# EAGLE design H26R10 (EAGLE 9.3.0)

## Sheet 1 of 2
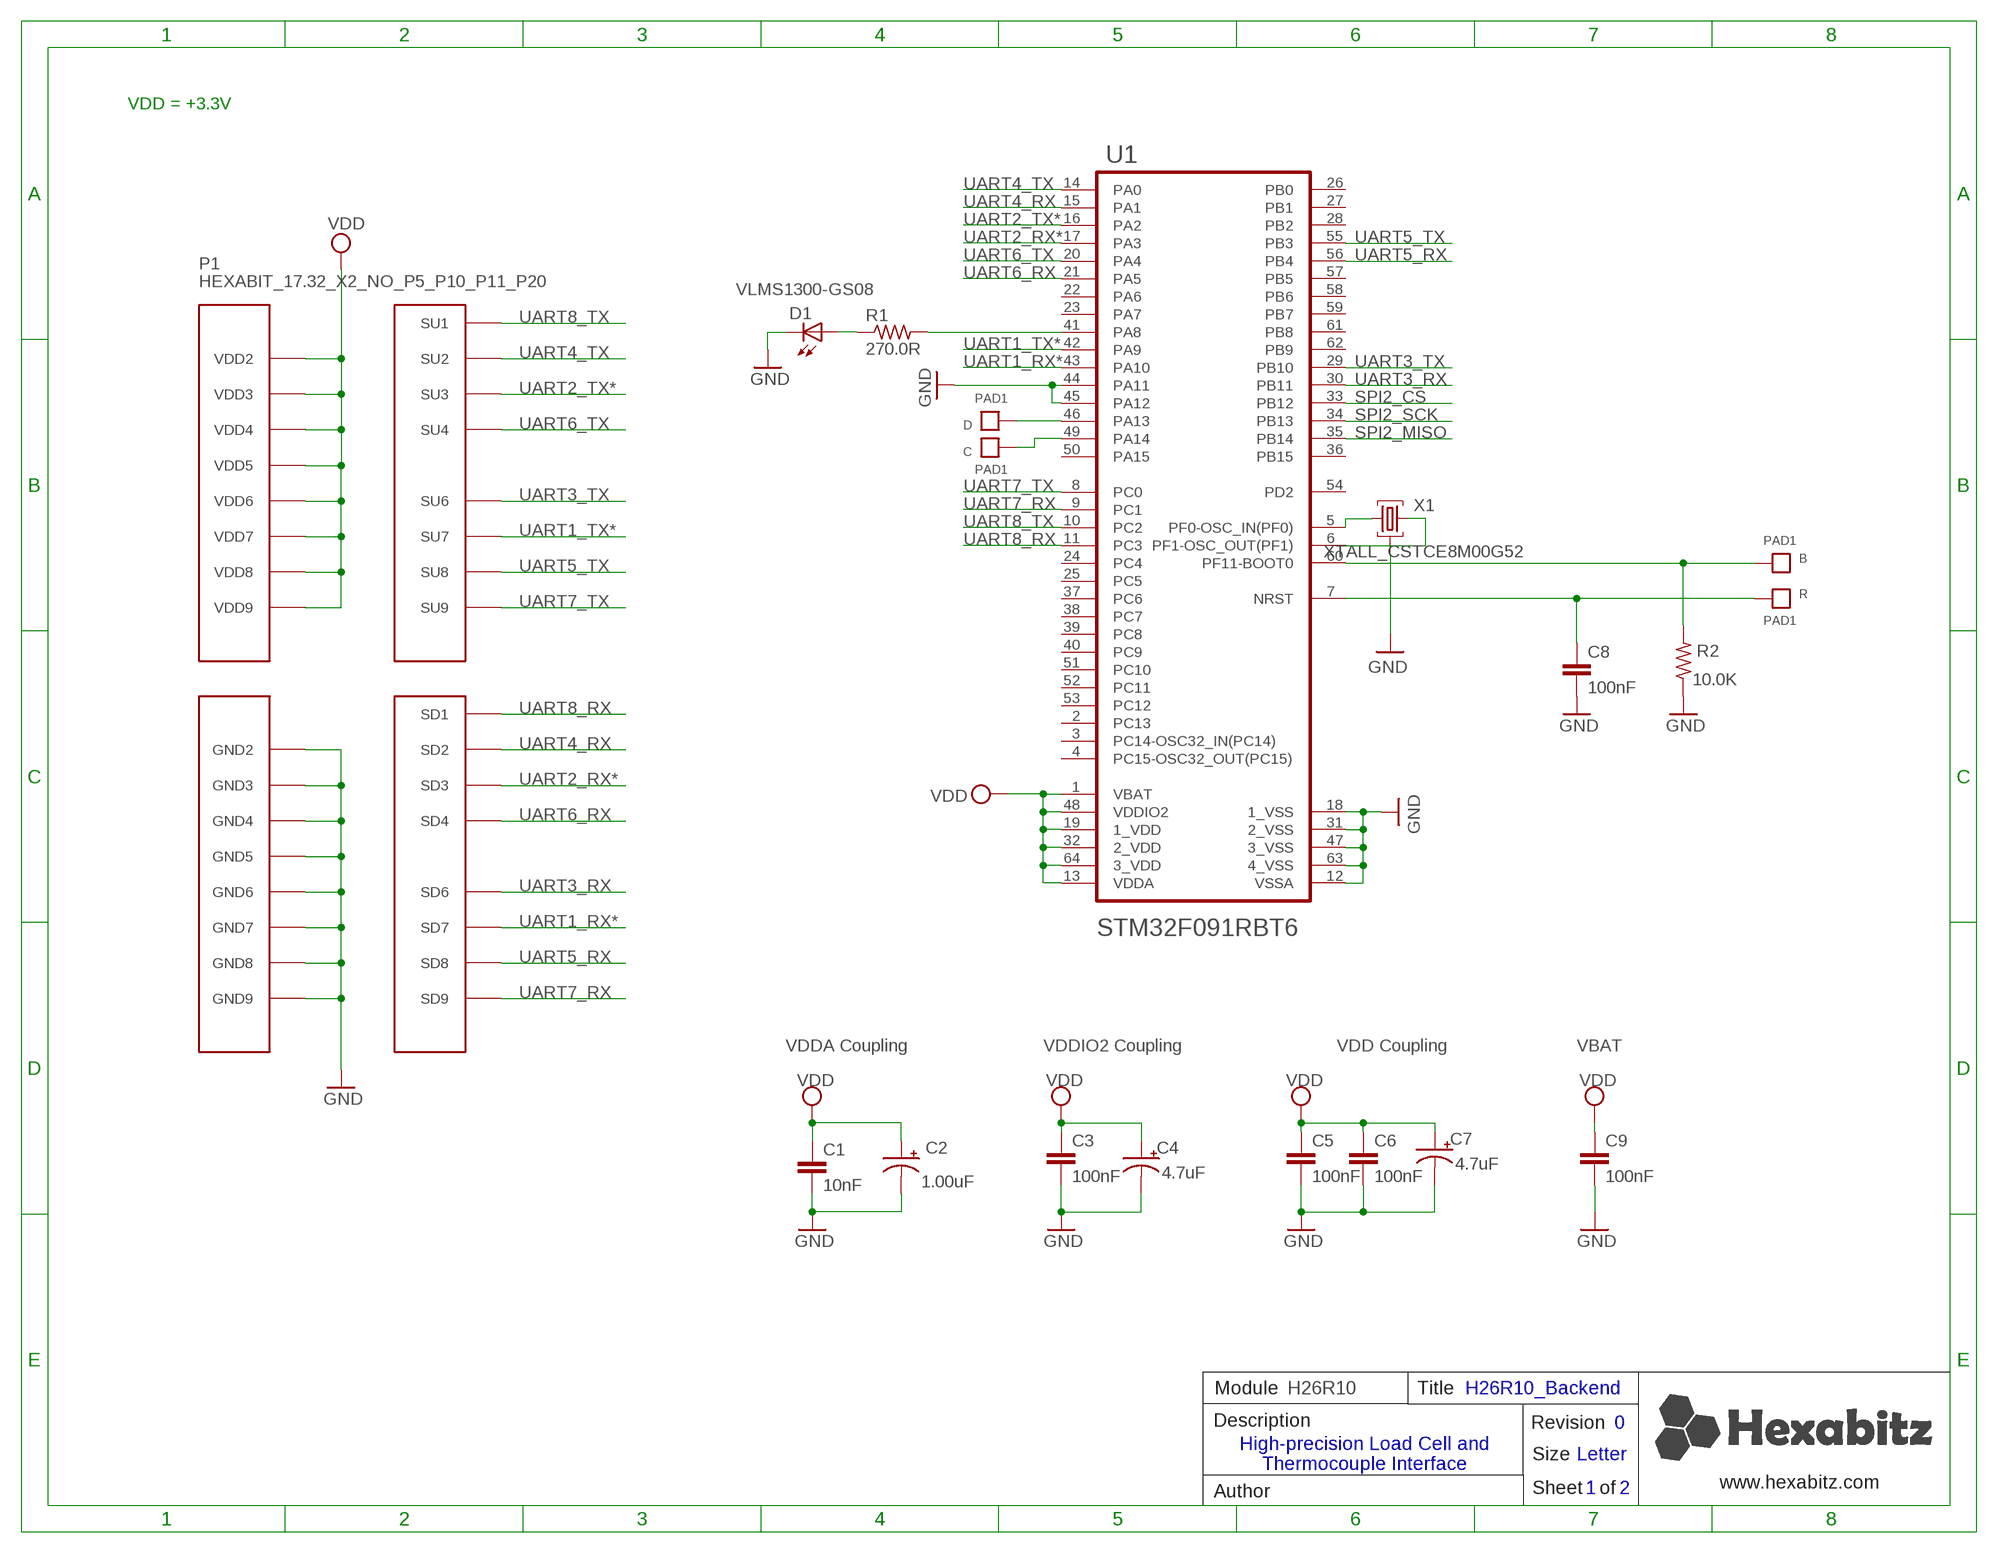
[diagram p0: schematic, sheet 1]

### Parts
B  PAD1  [PAD1]
C  PAD1  [PAD1]
C1  10nF  C-0603  [C-0603]
C2  1.00uF  C-0805-POL  [C-0805-POL]
C3  100nF  C-0603  [C-0603]
C4  4.7uF  C-0805-POL  [C-0805-POL]
C5  100nF  C-0603  [C-0603]
C6  100nF  C-0603  [C-0603]
C7  4.7uF  C-0805-POL  [C-0805-POL]
C8  100nF  C-0603  [C-0603]
C9  100nF  C-0603  [C-0603]
D  PAD1  [PAD1]
D1  VLMS1300-GS08  [VLMS1300-GS08]
P1  HEXABIT_17.32_X2_NO_P5_P10_P11_P20  [HEXABIT_17.32_X2_NO_P5_P10_P11_P20]
R  PAD1  [PAD1]
R1  270.0R  R-0603  [R-0603]
R2  10.0K  R-0603  [R-0603]
U1  STM32F091RBT6STMICROELECTRONICS_STM32F091RBT6_0_1  [STMICROELECTRONICS_STM32F091RBT6_1]
X1  XTALL_CSTCE8M00G52  [XTALL_CSTCE8M00G52]

### Nets
B1: B.P$1 B.P$2 R2.2 U1.60(PF11-BOOT0)
GND: C1.2 C2.2(-) C3.2 C4.2(-) C5.2 C6.2 C7.2(-) C8.2 C9.2 D1.C P1.PAD_PD12(GND2) P1.PAD_PD13(GND3) P1.PAD_PD14(GND4) P1.PAD_PD15(GND5) P1.PAD_PD16(GND6) P1.PAD_PD17(GND7) P1.PAD_PD18(GND8) P1.PAD_PD19(GND9) R2.1 U1.12(VSSA) U1.18(1_VSS) U1.31(2_VSS) U1.44(PA11) U1.45(PA12) U1.47(3_VSS) U1.63(4_VSS) X1.P$2 ; also sheet 2
N$3: R1.2 U1.41(PA8)
N$4: D1.A R1.1
N$5: U1.5(PF0-OSC_IN(PF0)) X1.P$1
N$6: U1.6(PF1-OSC_OUT(PF1)) X1.P$3
N$7: D.P$1 D.P$2 U1.46(PA13)
N$9: C.P$1 C.P$2 U1.49(PA14)
R1: C8.1 R.P$1 R.P$2 U1.7(NRST)
SPI2_CS: U1.33(PB12) ; also sheet 2
SPI2_MISO: U1.35(PB14) ; also sheet 2
SPI2_SCK: U1.34(PB13) ; also sheet 2
UART1_RX*: P1.PAD_PD7(SD7) U1.43(PA10)
UART1_TX*: P1.PAD_PU7(SU7) U1.42(PA9)
UART2_RX*: P1.PAD_PD3(SD3) U1.17(PA3)
UART2_TX*: P1.PAD_PU3(SU3) U1.16(PA2)
UART3_RX: P1.PAD_PD6(SD6) U1.30(PB11)
UART3_TX: P1.PAD_PU6(SU6) U1.29(PB10)
UART4_RX: P1.PAD_PD2(SD2) U1.15(PA1)
UART4_TX: P1.PAD_PU2(SU2) U1.14(PA0)
UART5_RX: P1.PAD_PD8(SD8) U1.56(PB4)
UART5_TX: P1.PAD_PU8(SU8) U1.55(PB3)
UART6_RX: P1.PAD_PD4(SD4) U1.21(PA5)
UART6_TX: P1.PAD_PU4(SU4) U1.20(PA4)
UART7_RX: P1.PAD_PD9(SD9) U1.9(PC1)
UART7_TX: P1.PAD_PU9(SU9) U1.8(PC0)
UART8_RX: P1.PAD_PD1(SD1) U1.11(PC3)
UART8_TX: P1.PAD_PU1(SU1) U1.10(PC2)
VDD: C1.1 C2.1(+) C3.1 C4.1(+) C5.1 C6.1 C7.1(+) C9.1 P1.PAD_PU12(VDD2) P1.PAD_PU13(VDD3) P1.PAD_PU14(VDD4) P1.PAD_PU15(VDD5) P1.PAD_PU16(VDD6) P1.PAD_PU17(VDD7) P1.PAD_PU18(VDD8) P1.PAD_PU19(VDD9) U1.1(VBAT) U1.13(VDDA) U1.19(1_VDD) U1.32(2_VDD) U1.48(VDDIO2) U1.64(3_VDD) ; also sheet 2
Unconnected: U1.2(PC13) U1.3(PC14-OSC32_IN(PC14)) U1.4(PC15-OSC32_OUT(PC15)) U1.22(PA6) U1.23(PA7) U1.24(PC4) U1.25(PC5) U1.26(PB0) U1.27(PB1) U1.28(PB2) U1.36(PB15) U1.37(PC6) U1.38(PC7) U1.39(PC8) U1.40(PC9) U1.50(PA15) U1.51(PC10) U1.52(PC11) U1.53(PC12) U1.54(PD2) U1.57(PB5) U1.58(PB6) U1.59(PB7) U1.61(PB8) U1.62(PB9)

### Notes on the sheet
- VDD = +3.3V
- VDDA Coupling | VDDIO2 Coupling | VDD Coupling | VBAT
- Module | H26R10 | Title | H26R10_Backend
- Description | Revision | 0
- High-precision Load Cell and
  Thermocouple Interface
- Size | Letter
- www.hexabitz.com
- Author | Sheet   of | 1 | 2
- C:/Users/Admin/Desktop/logodraft.bmp

## Sheet 2 of 2
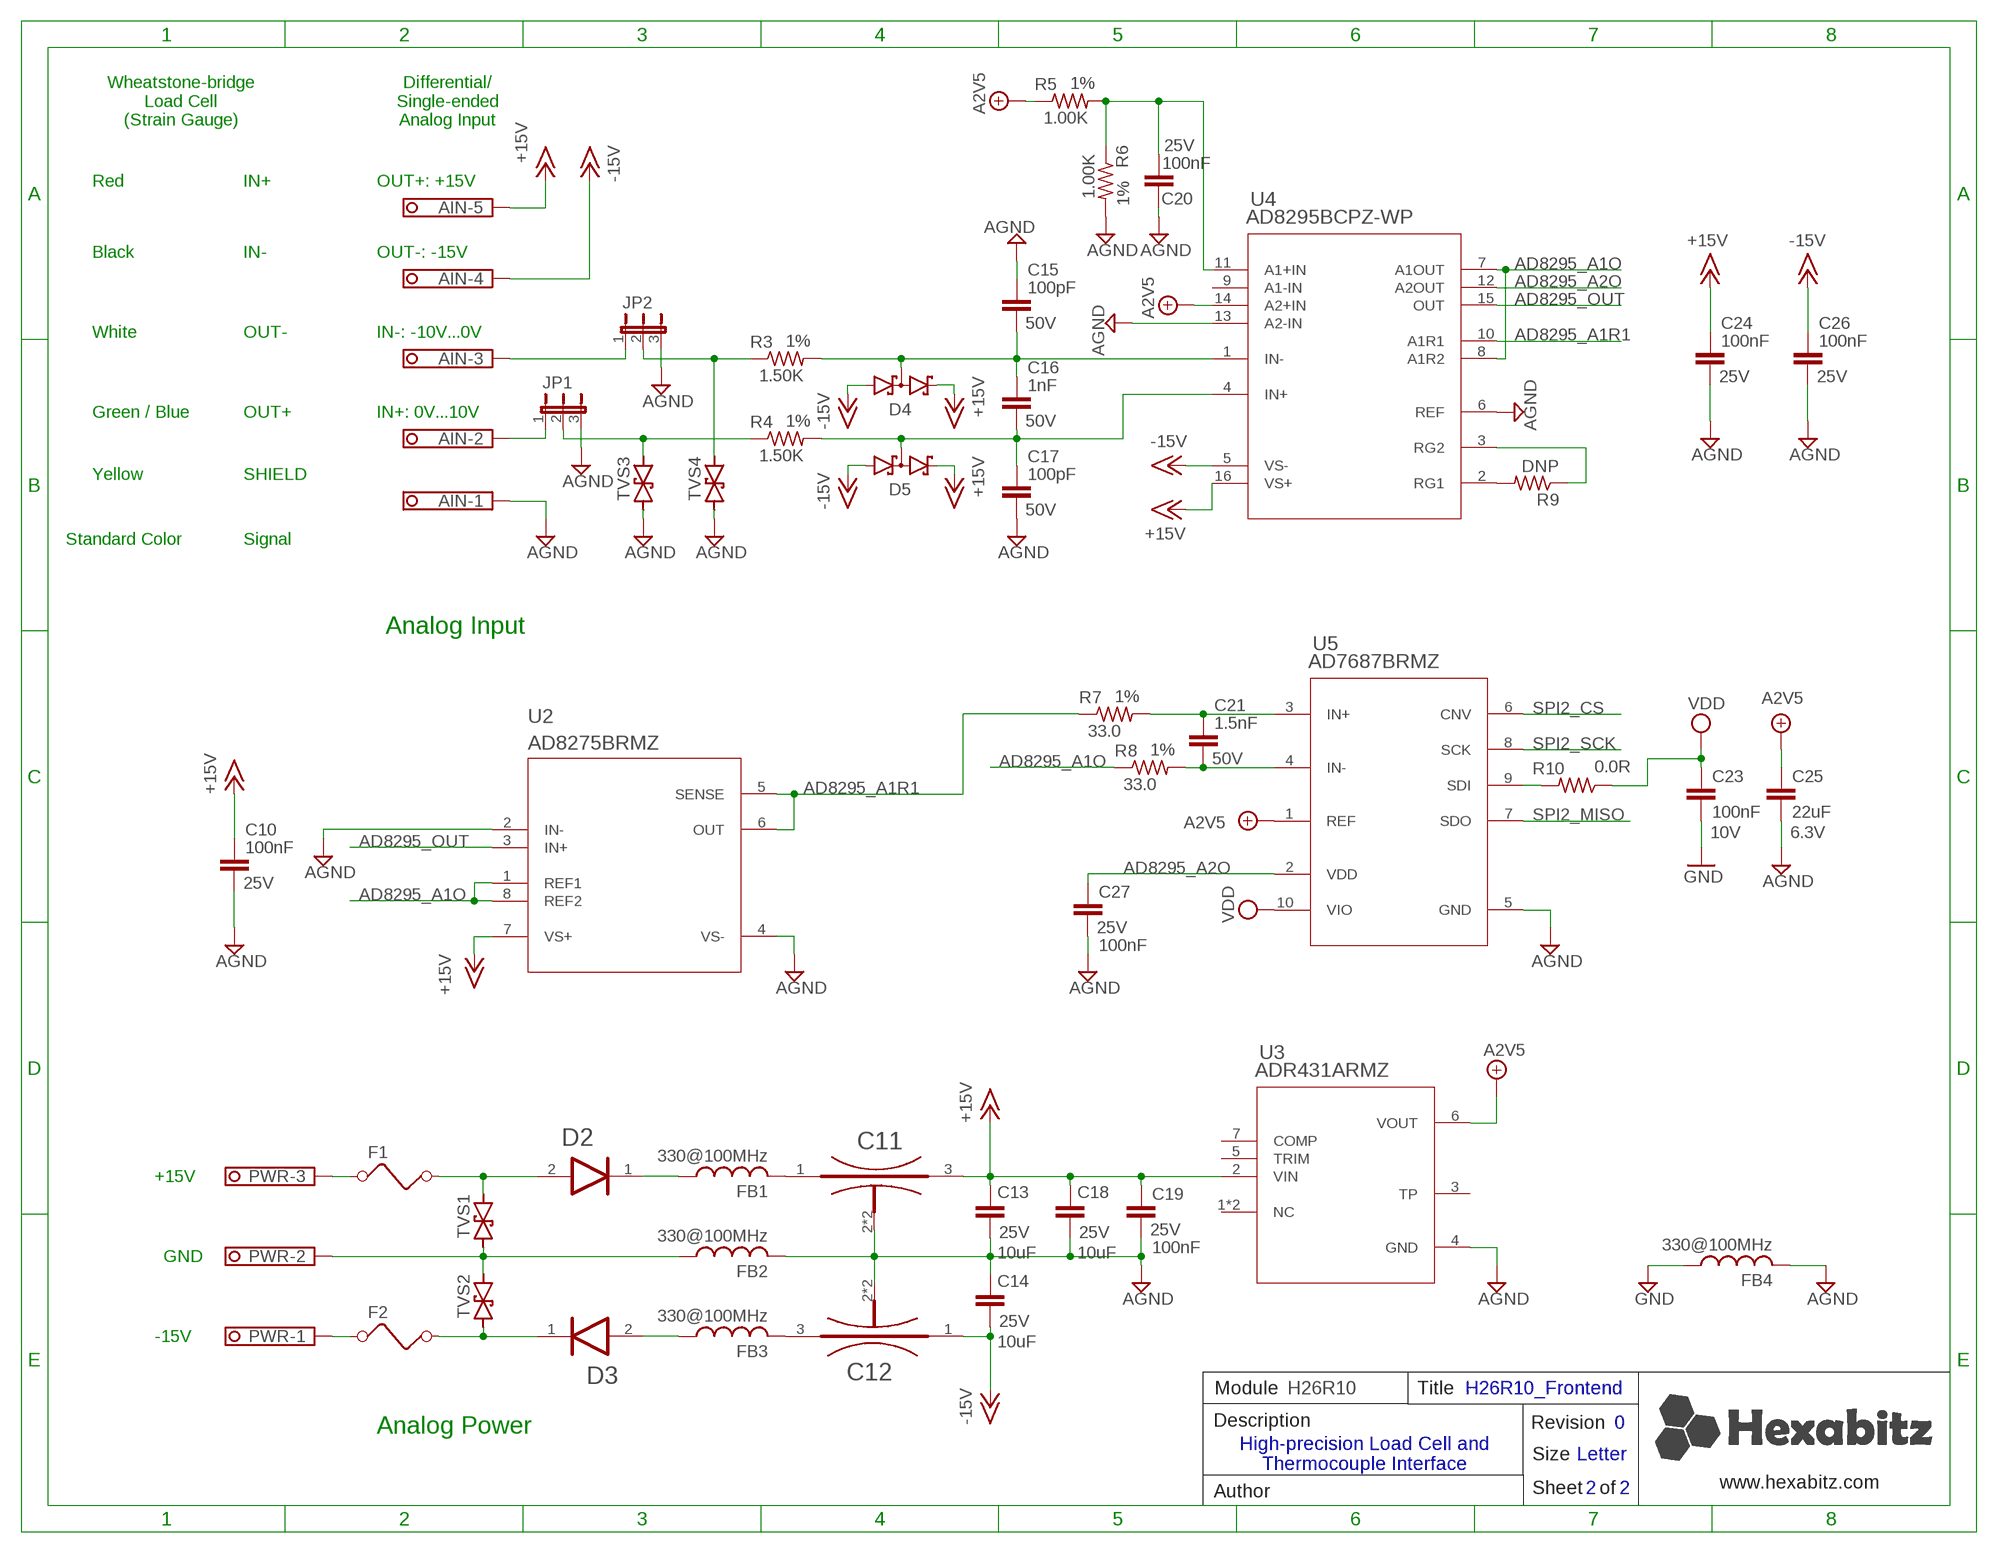
[diagram p1: schematic, sheet 2]

### Parts
AIN  CON-PHOENIX-350_1751277  [CON-PHOENIX-350_1751277]
C10  100nF  C-0603  [C-0603]
C11  MURATA_NFM21PC105B1A3DMURATA_NFM21PC105B1A3D_0_0  [MURATA_NFM21PC105B1A3D_0]
C12  MURATA_NFM21PC105B1A3DMURATA_NFM21PC105B1A3D_0_0  [MURATA_NFM21PC105B1A3D_0]
C13  10uF  C-1206  [C1206K]
C14  10uF  C-1206  [C1206K]
C15  100pF  C-0603  [C-0603]
C16  1nF  C-0603  [C-0603]
C17  100pF  C-0603  [C-0603]
C18  10uF  C-1206  [C1206K]
C19  100nF  C-0603  [C-0603]
C20  100nF  C-0603  [C-0603]
C21  1.5nF  C-0603  [C-0603]
C23  100nF  C-0603  [C-0603]
C24  100nF  C-0603  [C-0603]
C25  22uF  C-1206  [C1206K]
C26  100nF  C-0603  [C-0603]
C27  100nF  C-0603  [C-0603]
D2  DIODES_SBR2U30P1-7DIODES_SBR2U30P1-7_0_0  [DIODES_SBR2U30P1-7_0]
D3  DIODES_SBR2U30P1-7DIODES_SBR2U30P1-7_0_0  [DIODES_SBR2U30P1-7_0]
D4  BAT54S  [SOT23]
D5  BAT54S  [SOT23]
F1  NANOSMDC035F-2120  [R1206]
F2  NANOSMDC035F-2120  [R1206]
FB1  330@100MHz  FB-0805  [FB-0805]
FB2  330@100MHz  FB-0805  [FB-0805]
FB3  330@100MHz  FB-0805  [FB-0805]
FB4  330@100MHz  FB-0805  [FB-0805]
JP1  JP2E  [JP2]
JP2  JP2E  [JP2]
PWR  1751251  [1751251]
R3  1.50K  R-0603  [R-0603]
R4  1.50K  R-0603  [R-0603]
R5  1.00K  R-0603  [R-0603]
R6  1.00K  R-0603  [R-0603]
R7  33.0  R-0603  [R-0603]
R8  33.0  R-0603  [R-0603]
R9  DNP  R-0805  [R-0805]
R10  0.0R  R-0603  [R-0603]
TVS1  SMBJ30CA  [DO214AA]
TVS2  SMBJ30CA  [DO214AA]
TVS3  SMBJ30CA  [DO214AA]
TVS4  SMBJ30CA  [DO214AA]
U2  AD8275BRMZ  [RM_8]
U3  ADR431ARMZ  [RM_8]
U4  AD8295BCPZ-WP  [CP_16_19]
U5  AD7687BRMZ  [RM_10]

### Nets
+2.5V: C25.1 R5.1 U3.6(VOUT) U4.14(A2+IN) U5.1(REF) ; supply symbol labelled A2V5
+15V: AIN.5 C10.1 C11.3(OUTPUT) C13.1 C18.1 C19.1 C24.1 D4.2(C2) D5.2(C2) U2.7(VS+) U3.2(VIN) U4.16(VS+)
-15V: AIN.4 C12.1(INPUT) C14.2 C26.1 D4.1(A1) D5.1(A1) U4.5(VS-)
AD8295_A1O: R8.1 U2.1(REF1) U2.8(REF2) U4.7(A1OUT) U4.8(A1R2)
AD8295_A1R1: R7.1 U2.5(SENSE) U2.6(OUT) U4.10(A1R1)
AD8295_A2O: C27.1 U4.12(A2OUT) U5.2(VDD)
AD8295_OUT: U2.3(IN+) U4.15(OUT)
AGND: AIN.1 C10.2 C11.2(GND) C11.2-2(GND) C12.2(GND) C12.2-2(GND) C13.2 C14.1 C15.1 C17.2 C18.2 C19.2 C20.1 C24.2 C25.2 C26.2 C27.2 FB2.2 FB4.2 JP1.3 JP2.3 R6.2 TVS3.A TVS4.A U2.2(IN-) U2.4(VS-) U3.4(GND) U4.6(REF) U4.13(A2-IN) U5.5(GND)
GND: C23.2 FB4.1 ; also sheet 1
N$1: AIN.3 JP2.1
N$2: AIN.2 JP1.1
N$8: JP2.2 R3.1 TVS4.C
N$10: JP1.2 R4.1 TVS3.C
N$11: C15.2 C16.1 D4.3(C1A2) R3.2 U4.1(IN-)
N$12: C16.2 C17.1 D5.3(C1A2) R4.2 U4.4(IN+)
N$13: R9.2 U4.2(RG1)
N$14: R9.1 U4.3(RG2)
N$15: F1.1 PWR.3
N$16: F2.1 PWR.1
N$17: D2.2(ANODE) F1.2 TVS1.C
N$18: D3.1(CATHODE) F2.2 TVS2.A
N$19: FB2.1 PWR.2 TVS1.A TVS2.C
N$20: D2.1(CATHODE) FB1.1
N$21: D3.2(ANODE) FB3.1
N$22: C11.1(INPUT) FB1.2
N$23: C12.3(OUTPUT) FB3.2
N$25: C20.2 R5.2 R6.1 U4.11(A1+IN)
N$26: R10.2 U5.9(SDI)
N$27: C21.1 R7.2 U5.3(IN+)
N$28: C21.2 R8.2 U5.4(IN-)
SPI2_CS: U5.6(CNV) ; also sheet 1
SPI2_MISO: U5.7(SDO) ; also sheet 1
SPI2_SCK: U5.8(SCK) ; also sheet 1
VDD: C23.1 R10.1 U5.10(VIO) ; also sheet 1
Unconnected: U3.1(NC) U3.3(TP) U3.5(TRIM) U3.7(COMP) U3.8(NC) U4.9(A1-IN)

### Notes on the sheet
- Wheatstone-bridge
  Load Cell
  (Strain Gauge)
- Differential/
  Single-ended
  Analog Input
- Red | IN+ | OUT+: +15V
- Black | IN- | OUT-: -15V
- White | OUT- | IN-: -10V...0V
- Green / Blue | OUT+ | IN+: 0V...10V
- Yellow | SHIELD
- Standard Color | Signal
- Analog Input
- +15V
- GND
- -15V
- Module | H26R10 | Title | H26R10_Frontend
- Description | Revision | 0
- Analog Power
- High-precision Load Cell and
  Thermocouple Interface
- Size | Letter
- www.hexabitz.com
- Author | Sheet   of | 2 | 2

## Library data of the parts
AIN = Hexabitz:CON-PHOENIX-350_1751277: MKDS 1/ 5-3,5 Printklemme Nennstrom: 10 A Bemessungsspannung: 160 V Raster: 3,5 mm Polzahl: 5 Montageart: Löten Anschlussart: Schraubanschluss Anschlussrichtung vom Leiter zur Platine: 0° Source: http://eshop.phoenixcontact.com .. 1751277.pdf; MFN: Phoenix Contact; MPN: 1984646; OCTOPART_URL: https://octopart.com/1984646-phoenix+contact-50274?r=sp&s=drI_GVM4QHaL48lSCATrxQ; OC_FARNELL: unknown; OC_NEWARK: unknown
B C D R = Hexabitz:PAD1
C1 = Hexabitz:C-0603: CAP CER 10% X7R 0603; CAPACITANCE: 10nF; MFN: KEMET; MPN: C0603C103K5RACTU; OCTOPART_URL: https://octopart.com/c0603c103k5ractu-kemet-133094?r=sp&s=R_iPBxLnSmGqhkU2rIMFpg; TOLERANCE: 10%; VOLTAGE_RATING: 50V
C2 = Hexabitz:C-0805-POL: Cap Tant Solid SMD 2012; CAPACITANCE: 1.00uF; MFN: Yageo; MPN: CC0805KKX7R7BB105; OCTOPART_URL: https://octopart.com/cc0805kkx7r7bb105-yageo-8376555?r=sp&s=YKl1wwtkROau_X5nniH2ig; TOLERANCE: 10%; VOLTAGE_RATING: 16V
C3 C6 C8 C23 = Hexabitz:C-0603: CAP CER 10% X7R 0603; CAPACITANCE: 100nF; MFN: KEMET; MPN: C0603C104K8RACTU; OCTOPART_URL: https://octopart.com/c0603c104k8ractu-kemet-145075?r=sp&s=9bS9ASSwSEqMCE9KBEQZ0g; TOLERANCE: 10%; VOLTAGE_RATING: 10V
C4 C7 = Hexabitz:C-0805-POL: Cap Tant Solid SMD 2012; CAPACITANCE: 4.7uF; MFN: Murata; MPN: GRM21BC81E475KA12L; OCTOPART_URL: https://octopart.com/grm21bc81e475ka12l-murata-10331911?r=sp&s=RY3qZSD8T6mG6TC9CHI5qQ; TOLERANCE: 10%; VOLTAGE_RATING: 25V
C5 = Hexabitz:C-0603: CAP CER 10% X7R 0603; CAPACITANCE: 100nF; MFN: KEMET; MPN: C0603C104K8RACTU; OCTOPART_URL: https://octopart.com/c0603c104k8ractu-kemet-145075?r=sp&s=9bS9ASSwSEqMCE9KBEQZ0g; TOLERANCE: 10%; VOLTAGE_RATING: 10
C9 = Hexabitz:C-0603: CAP CER 10% X7R 0603; CAPACITANCE: 100nF; MFN: KEMET; MPN: C0603C104K8RACTU; OCTOPART_URL: https://octopart.com/c0603c104k8ractu-kemet-145075?r=sp&s=9bS9ASSwSEqMCE9KBEQZ0g; TOLERANCE: 10V; VOLTAGE_RATING: 10%
C10 C24 C26 C27 = Hexabitz:C-0603: CAP CER 10% X7R 0603; CAPACITANCE: 100nF; MFN: Murata; MPN: GRM188R71E104KA01D; OCTOPART_URL: https://octopart.com/grm188r71e104ka01d-murata-196239?r=sp&s=9Sa0iYM-THq9pjXKXbxryA; TOLERANCE: 10%; VOLTAGE_RATING: 25V
C11 C12 = Hexabitz:MURATA_NFM21PC105B1A3D: Large Current 3 Terminals Low ESL Chip Multilayer Ceramic Capacitors (EMIFIL) for General Purpose; CAPACITANCE: 1µF; CENTROID_NOT_SPECIFIED: No; DATASHEET: http://search.murata.co.jp/Ceramy/image/img/A01X/G101/ENG/NFM21PC105B1A3-01.pdf; DIGIKEY_DESCRIPTION: CAP FEEDTHRU 1UF 20% 10V 0805; DIGIKEY_PART_NUMBER: 490-6980-1-ND; LEAD_FREE: yes; MFN: Murata; MOUSER_PART_NUMBER: 81-NFM21PC105B1A3D; MPN: NFM21PC105B1A3D; OCTOPART_URL: https://octopart.com/nfm21pc105b1a3d-murata-755259?r=sp&s=hLu_FErQSKe5ZWS_KJzJIw#; PACKAGE: 0805 (2012 metric); PREFIX: C; ROHS: yes; TEMPERATURE_RANGE_HIGH: +85°C; TEMPERATURE_RANGE_LOW: -40°C
C13 C14 C18 = Hexabitz:C-1206: Cap Tant Solid SMD 1210; MFN: Yageo; MPN: CC1206ZKY5V8BB106; OCTOPART_URL: https://octopart.com/cc1206zky5v8bb106-yageo-42624311?r=sp&s=EIqUUxkfRLaCHNQsufUkfg; VOLTAGE: 25V
C15 C17 = Hexabitz:C-0603: CAP CER 10% X7R 0603; CAPACITANCE: 100pF; MFN: Vishay; MPN: VJ0603A101JXACW1BC; OCTOPART_URL: https://octopart.com/vj0603a101jxacw1bc-vishay-39475624?r=sp&s=h5A-QmSyQQCOzGQSLrVH3g; TOLERANCE: 5%; VOLTAGE_RATING: 50V
C16 = Hexabitz:C-0603: CAP CER 10% X7R 0603; CAPACITANCE: 1nF; MFN: KEMET; MPN: C0603C102J5RACTU; OCTOPART_URL: https://octopart.com/c0603c102j5ractu-kemet-96704?r=sp&s=FTT-GbZETU-THqdDiH9Eqg; TOLERANCE: 5%; VOLTAGE_RATING: 50V
C19 C20 = Hexabitz:C-0603: CAP CER 10% X7R 0603; CAPACITANCE: 100nF; MFN: KEMET; MPN: C0603C104K8RACTU; OCTOPART_URL: https://octopart.com/c0603c104k8ractu-kemet-145075?r=sp&s=9bS9ASSwSEqMCE9KBEQZ0g; TOLERANCE: 10%; VOLTAGE_RATING: 25V
C21 = Hexabitz:C-0603: CAP CER 10% X7R 0603; CAPACITANCE: 1.5nF; MFN: Murata; MPN: GRM188R71H152KA01D; OCTOPART_URL: https://octopart.com/grm188r71h152ka01d-murata-196214?r=sp&s=B3tXpj9TSXK0Uf-xUEtnoQ; TOLERANCE: 10%; VOLTAGE_RATING: 50V
C25 = Hexabitz:C-1206: Cap Tant Solid SMD 1210; MFN: TDK; MPN: C3216X5R0J226M085AC; OCTOPART_URL: https://octopart.com/c3216x5r0j226m085ac-tdk-25947770?r=sp&s=pSAbGtd3SEaaGVnK6LPutg; VOLTAGE: 6.3V
D1 = Hexabitz:VLMS1300-GS08: Red 0603 130° Clear 54 mcd 2 V Surface Mount ChipLED ; Octopart Url : http://octopart.com/vlms1300-gs08-vishay-21709201; MFN: Vishay; MPN: VLMS1300-GS08; OCTOPART_URL: https://octopart.com/vlms1300-gs08-vishay-21709201?r=sp&s=_gcP4_q8T1SC6PJQPTQ9yA
D2 D3 = Hexabitz:DIODES_SBR2U30P1-7: 2.0A SBR SUPER BARRIER RECTIFIER POWERDI123; AVERAGE_RECTIFIED_OUTPUT_CURRENT: 2A; CENTROID_NOT_SPECIFIED: No; DATASHEET: https://www.diodes.com/assets/Datasheets/SBR2U30P1.pdf; DC_BLOCKING_VOLTAGE: 30V; DIGIKEY_DESCRIPTION: DIODE SBR 30V 2A POWERDI123; DIGIKEY_PART_NUMBER: SBR2U30P1DICT-ND; LEAD_FREE: yes; MF: Diodes; MFN: Diodes; MOUSER_PART_NUMBER: 621-SBR2U30P1-7; MPN: SBR2U30P1-7; OCTOPART_URL: https://octopart.com/sbr2u30p1-7-diodes+inc.-13160632?r=sp&s=T9EzcoJOQBe5XnC2-oZtAA; PACKAGE: POWERDI123; PEAK_REPETITIVE_REVERSE_VOLTAGE: 30V; PREFIX: D; RMS_REVERSE_VOLTAGE: 21V; ROHS: yes; TEMPERATURE_RANGE_HIGH: +150°C; TEMPERATURE_RANGE_LOW: -65°C; WORKING_PEAK_REVERSE_VOLTAGE: 30V
D4 D5 = Hexabitz:BAT54S: Schottky Diodes; MFN: ON Semiconductor; MPN: BAT54S; OCTOPART_URL: https://octopart.com/bat54s-on+semiconductor-18638425?r=sp&s=0oE-1-iASiqsaei8bbDRSA
F1 F2 = Hexabitz:NANOSMDC035F-2: PTC Resettable Fuse 0.35A(hold) 0.75A(trip) 16VDC 20A 0.6W 0.1s 0.45Ohm SMD Solder Pad 1206; MFN: Littelfuse; MPN: NANOSMDC035F-2; OCTOPART_URL: https://octopart.com/nanosmdc035f-2-littelfuse-74215052?r=sp&s=rfNZOPvgSJy5H1V-bbPI5Q#
FB1-FB4 = Hexabitz:FB-0805: Ferrite Beads Multi-Layer 0805; MFN: Murata; MPN: BLM21PG331SN1D; OCTOPART_URL: https://octopart.com/blm21pg331sn1d-murata-755248?r=sp&s=pVkAwURpTXWiHCzKxLHPKg
JP1 JP2 = jumper:JP2E: JUMPER; MFN: TE Connectivity; MPN: 5-146274-3; OCTOPART_URL: https://octopart.com/5-146274-3-te+connectivity-41331935?r=sp&s=NjXWWcEMSlCn9lUGtOE76Q
P1 = hexabitz_connectors:HEXABIT_?_X2_NO_P5_P10_P11_P20: Hexabitz Double Hexagon Module Connector Hexagon side length = 17.32mm. The following ports are removed: P5, P10, P11, P12
PWR = con-phoenix-350:1751251: MKDS 1/ 3-3,5 Printklemme Nennstrom: 10 A Bemessungsspannung: 160 V Raster: 3,5 mm Polzahl: 3 Montageart: Löten Anschlussart: Schraubanschluss Anschlussrichtung vom Leiter zur Platine: 0° Source: http://eshop.phoenixcontact.com .. 1751251.pdf; MFN: Phoenix Contact; MPN: 1751251; OCTOPART_URL: https://octopart.com/1751251-phoenix+contact-36473?r=sp&s=9M0VWNoHTyq04j3qI6lQOQ; OC_FARNELL: unknown; OC_NEWARK: unknown
R1 = Hexabitz:R-0603: Thick Film Resistors - SMD 0603; MFN: Yageo; MPN: RC0603FR-07270RL; OCTOPART_URL: https://octopart.com/search?q=RC0603FR-07270RL&start=0; RESISTANCE: 270.0 Ohm; TOLERANCE: 1%
R2 = Hexabitz:R-0603: Thick Film Resistors - SMD 0603; MFN: Yageo; MPN: RC0603JR-0710KL; OCTOPART_URL: https://octopart.com/search?q=RC0603JR-0710KL&start=0; RESISTANCE: 10.0K Ohm; TOLERANCE: 5%
R3 R4 = Hexabitz:R-0603: Thick Film Resistors - SMD 0603; MFN: Vishay; MPN: CRCW08051K50FKEA; OCTOPART_URL: https://octopart.com/crcw08051k50fkea-vishay-39438952?r=sp&s=FTVHJLNNRCutFFVKF5OI1Q; RESISTANCE: 1.50K; TOLERANCE: 1%
R5 R6 = Hexabitz:R-0603: Thick Film Resistors - SMD 0603; MFN: Yageo; MPN: RC0603FR-0710KL; OCTOPART_URL: https://octopart.com/rc0603fr-0710kl-yageo-40025538?r=sp&s=SQw8RrYPSD2xso48oCtW2w; RESISTANCE: 1.00K; TOLERANCE: 1%
R7 R8 = Hexabitz:R-0603: Thick Film Resistors - SMD 0603; MFN: Vishay; MPN: CRCW060333R0FKEA; OCTOPART_URL: https://octopart.com/crcw060333r0fkea-vishay-39800560?r=sp&s=wp7g9KNrTAyIb5rPlfFDGg; RESISTANCE: 33.0; TOLERANCE: 1%
R9 = Hexabitz:R-0805: Thick Film Resistors - SMD 0605
R10 = Hexabitz:R-0603: Thick Film Resistors - SMD 0603; MFN: Yageo; MPN: RC0603JR-070RL; OCTOPART_URL: https://octopart.com/rc0603jr-070rl-yageo-1241539?r=sp&s=X2NteqRjRNWrnx42Y0aliA; RESISTANCE: 0.0 Ohm
TVS1-TVS4 = Hexabitz:SMBJ30CA: TVS Diode; MFN: ON Semiconductor; MPN: SMBJ30CA; OCTOPART_URL: https://octopart.com/smbj30ca-on+semiconductor-84331460?r=sp&s=Vl5BdVYHQCeKmKgfbE4rMg
U1 = Hexabitz:STM32F091RBT6: MCU 32-bit ARM Cortex M0 RISC 128KB Flash 2.5V/3.3V 64-Pin LQFP Frame; CIIVA_IDS: 20240711; COMPONENT_LINK_1_DESCRIPTION: Manufacturer URL; COMPONENT_LINK_1_URL: http://www.st.com/; CORE: ARM Cortex-M0; DATASHEET: http://www.st.com/st-web-ui/static/active/en/resource/technical/document/datasheet/DM00115237.pdf; DATASHEET_VERSION: Rev. 2; DA_CONVERTER: 1; FLASH_SIZE_PROG_KB: 128; FOOTPRINT_VARIANT_NAME_0: Level C; FOOTPRINT_VARIANT_NAME_1: Level B; FOOTPRINT_VARIANT_NAME_2: Level A; IMPORTED: yes; IMPORTED_FROM: vault; IMPORT_TS: 1521852803; INTERNAL_RAM_SIZE_KB: 32; IOS_HIGH_CURRENT: 52; MF: STMicroelectronics; MFN: STMicroelectronics; MOUNTING_TECHNOLOGY: Surface Mount; MPN: STM32F091RBT6; OCTOPART_URL: https://octopart.com/stm32f091rbt6-stmicroelectronics-51988681?r=sp&s=nshh1g3RRwuzez1YsQrt1w; OPERATING_FREQUENCYF_PROCESSOR_SPEED_MHZ: 48; PACKAGE_DESCRIPTION: 64-Pin Low-profile Quad Flat Package, Body 10 x 10 mm, Pitch 0.5 mm; PACKAGE_REFERENCE: LQFP64; PACKING: Tray; PREFIX: U; RELEASE_DATE: 1490161467; SUPPLY_VOLTAGEVCC_MIN_V: 2; VAULT_GUID: 95B06E5F-7F06-470A-8EBC-FD74529BF319; VAULT_REVISION: C6B60D25-65BF-47EB-8D85-05054791449B
U2 = Hexabitz:AD8275BRMZ: G = 0.2, Level Translation, 16-Bit ADC Driver; MANUFACTURER_PART_NUMBER: AD8275BRMZ; MFN: Analog Devices; MPN: AD8275BRMZ; OCTOPART_URL: https://octopart.com/ad8275brmz-analog+devices-9563519?r=sp&s=G6FwvkoJRIKGm_UpidKVeA; VENDOR: Vendor
U3 = Hexabitz:ADR431ARMZ: Ultralow Noise XFET Voltage References with Current Sink and Source Capability; MFN: Analog Devices; MPN: ADR431ARMZ; OCTOPART_URL: https://octopart.com/adr431armz-analog+devices-522522?r=sp&s=zV9aTwb9SbKgScTRVCw3wA
U4 = Hexabitz:AD8295BCPZ-WP: Precision Instrumentation Amplifier with Signal Processing Amplifiers; MFN: Analog Devices; MPN: AD8295BCPZ-WP; OCTOPART_URL: https://octopart.com/ad8295bcpz-wp-analog+devices-17541165?r=sp&s=l3c7wRZFS06yY3Y4DbMCMg
U5 = Hexabitz:AD7687BRMZ: 16-Bit, 1.5 LSB INL, 250 kSPS PulSAR Differential ADC in MSOP; MANUFACTURER_PART_NUMBER: AD7687BRMZ; MFN: Analog Devices; MPN: AD7687BRMZ; OCTOPART_URL: https://octopart.com/ad7687brmz-analog+devices-402423?r=sp&s=nGWkWf3SRRmAtqyGurz69w; VENDOR: Vendor
X1 = Hexabitz:XTALL_CSTCE8M00G52: MURATA CSTCE8M00G52-R0 RESONATOR, SMD, 8MHZ ; Octopart Url : https://octopart.com/cstce8m00g52-r0-murata-7145559; MFN: Murata; MPN: CSTCE8M00G52Z-R0; OCTOPART_URL: https://octopart.com/cstce8m00g52z-r0-murata-17755941?r=sp&s=JDnNJnrHQhyS8Zk4ofFWXw

## Board
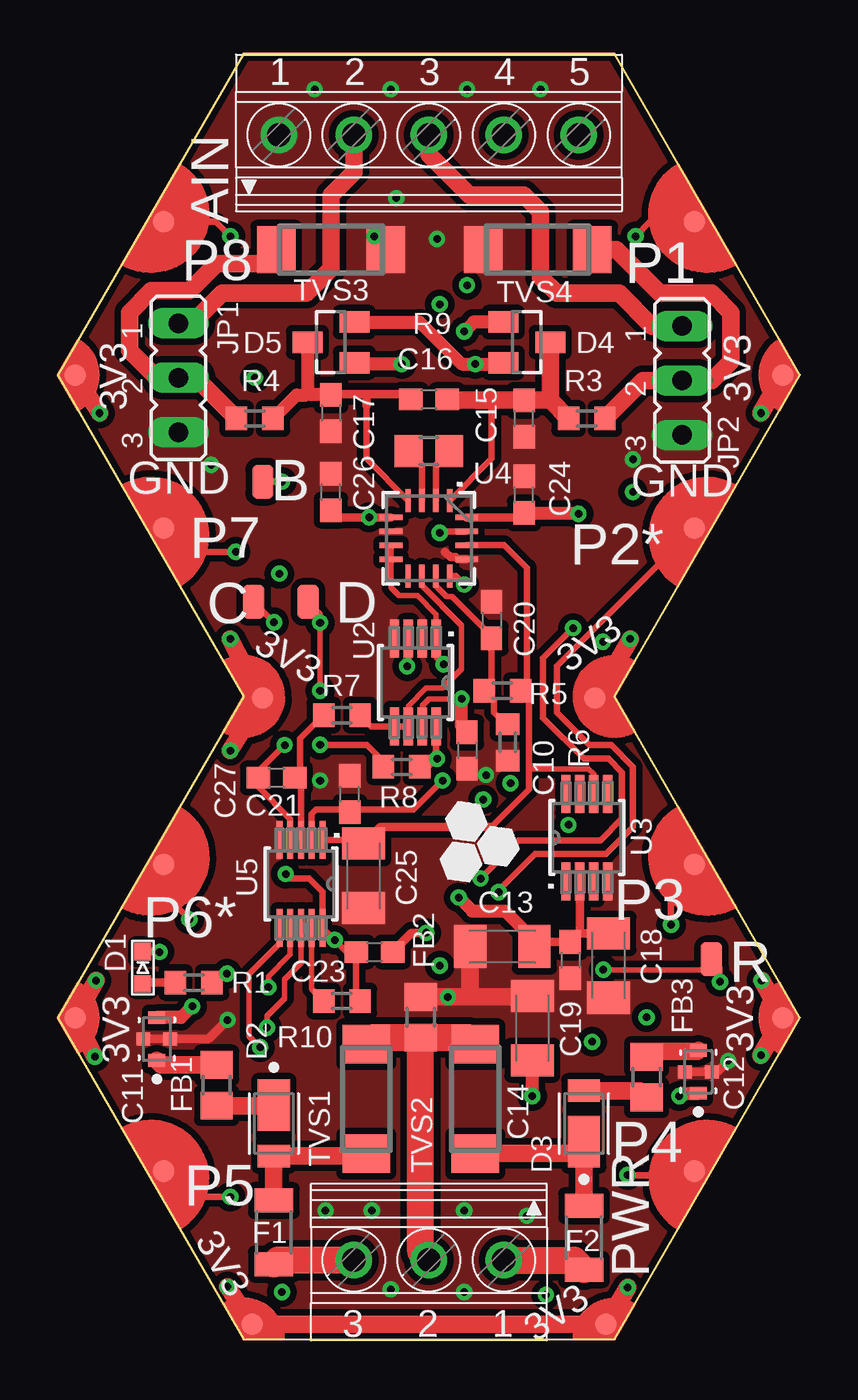
[diagram p2: board, top side]
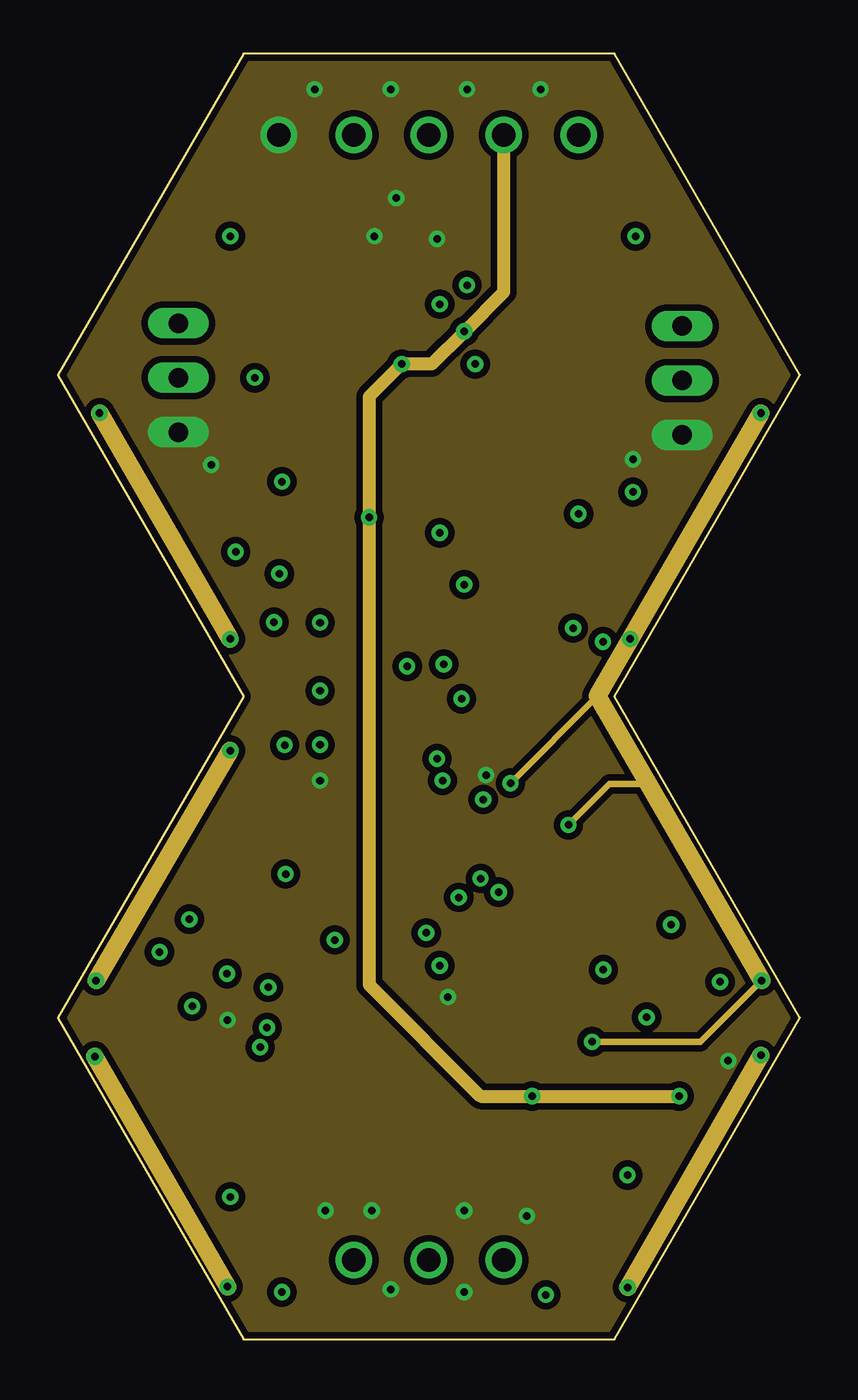
[diagram p3: board, inner layer Route2]
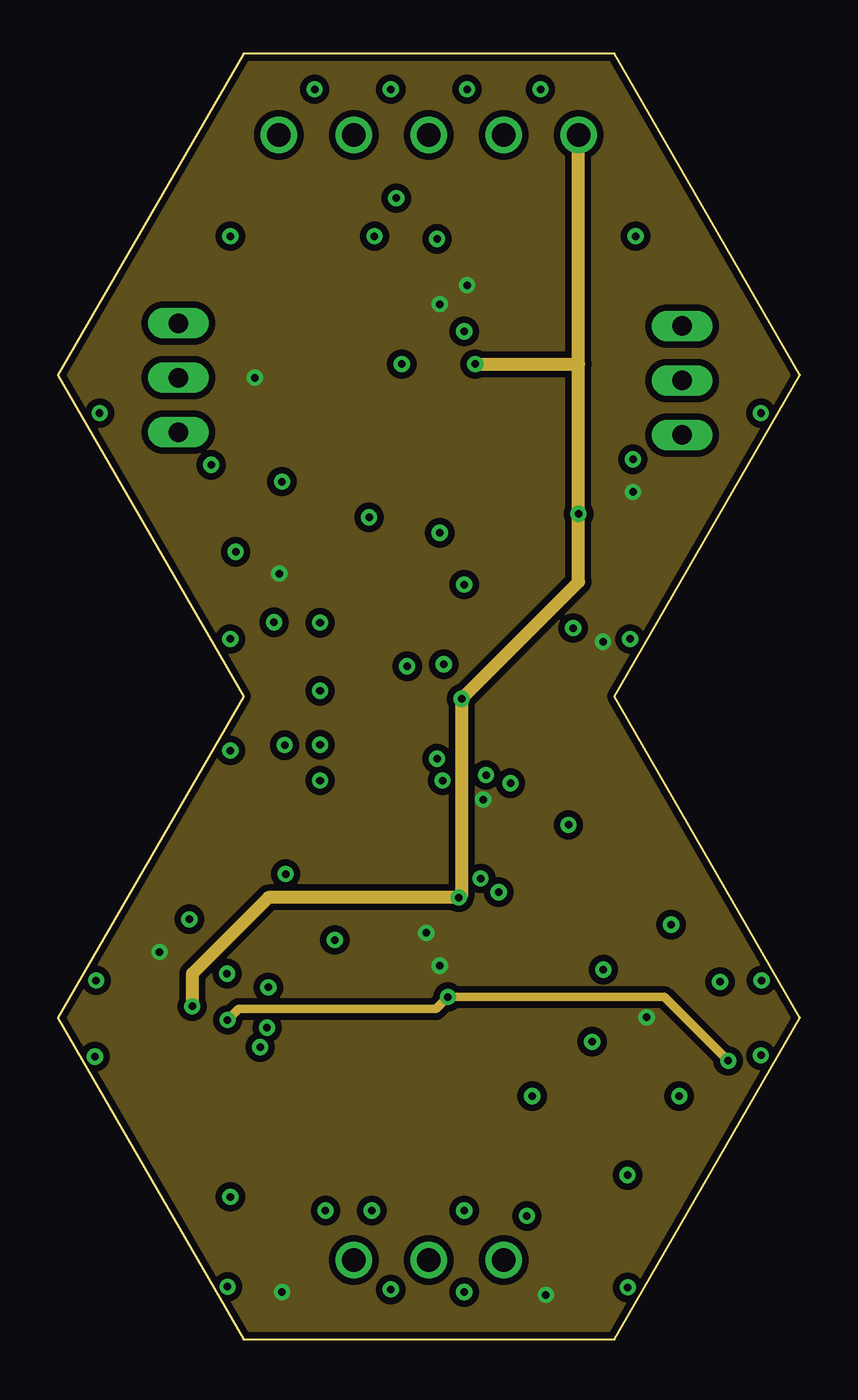
[diagram p4: board, inner layer Route15]
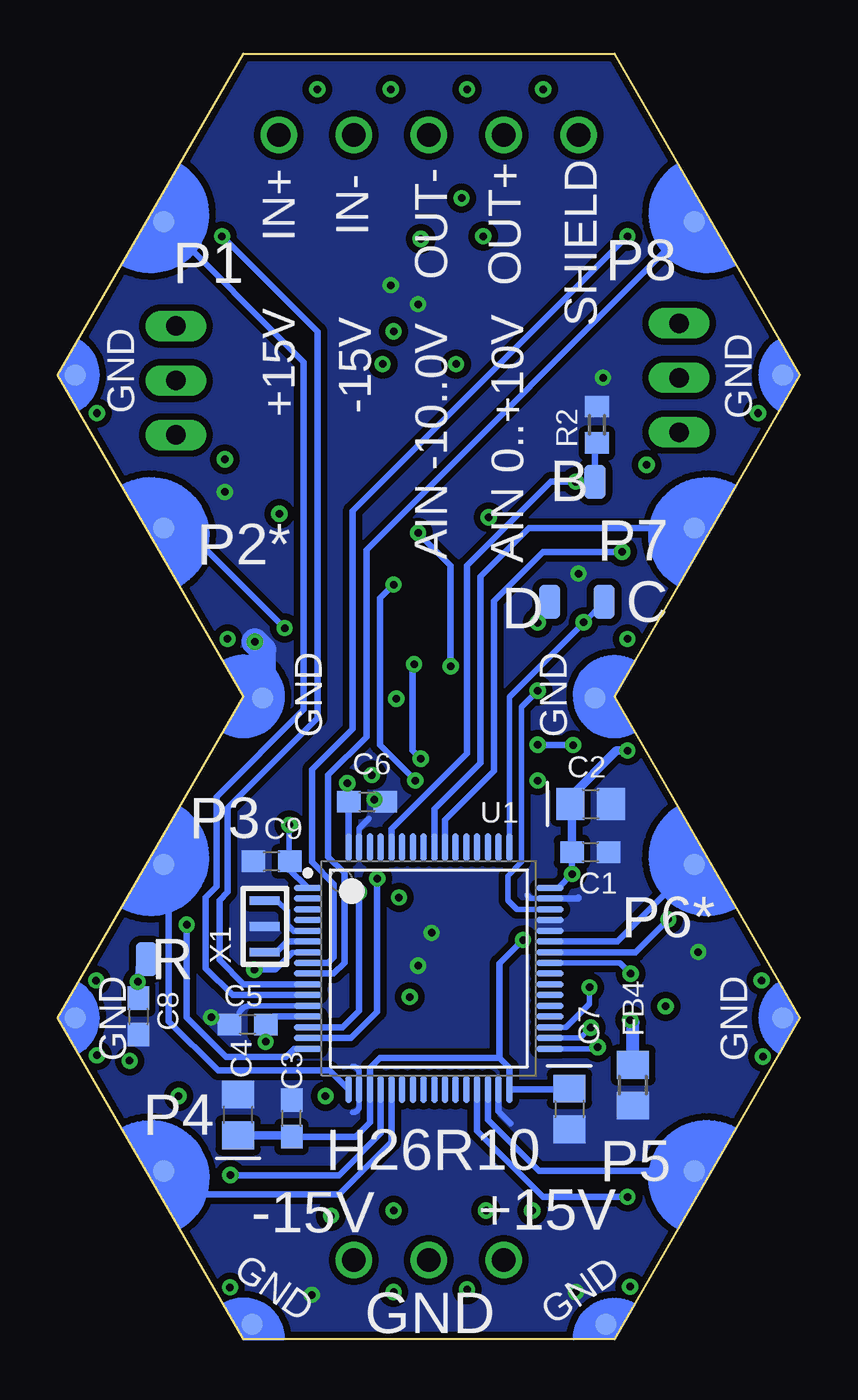
[diagram p5: board, bottom side, seen from below]

Size 34.64 x 60 mm. Coordinates in mm from the lower left corner, seen from the top.
Copper layers (1*2+15*16): Top 0.035mm / dielectric 0.175mm / Route2 0.035mm / dielectric 1.11mm / Route15 0.035mm / dielectric 0.175mm / Bottom 0.035mm
Design rules "2_layer *": minimum track width 7mil, minimum drill 10mil, track to track 6mil, track to pad 6mil, pad to pad 6mil, via to via 6mil, smd to smd 0mil, copper to edge 1mil, drill to drill 8mil, minimum pad ring 10mil, minimum via ring 8mil, stop-mask expansion 2mil, vias tented up to drill 15mil, thermal gap 10mil

### Footprints (pad centres in the part's own frame; a part is rotated, then mirrored left to right if it is on the bottom)
CON-PHOENIX-350_1751277 = drill 1.1 pad 1.7: 1 -7,-0.1; 2 -3.5,-0.1; 3 0,-0.1; 4 3.5,-0.1; 5 7,-0.1
PAD1 = smd 1.6 x 1: P$1 0,0 | smd 1.6 x 1 bottom: P$2 0,0
C-0603 = smd 1.1 x 1: 1 -0.85,0; 2 0.85,0
C-0805-POL = smd 1.3 x 1.5: 1 -0.95,0; 2 0.95,0
MURATA_NFM21PC105B1A3D_0 = smd 0.6 x 0.8: 1 -1,0; 3 1,0 | smd 0.6 x 0.65: 2 0,-0.625; 2-2 0,0.625
C1206K = smd 1.5 x 2: 1 -1.5,0; 2 1.5,0
VLMS1300-GS08 = smd 0.8 x 0.8: A 0,0.75; C 0,-0.75
DIODES_SBR2U30P1-7_0 = smd 2.4 x 1.5: 1 0.85,0 | smd 1.05 x 1.5: 2 -1.525,0
SOT23 = smd 1 x 1.4: 1 -0.95,-1.1; 2 0.95,-1.1; 3 0,1.1
R1206 = smd 1.12 x 1.8: 1 -1.49,0; 2 1.49,0
FB-0805 = smd 1.3 x 1.5: 1 -0.95,0; 2 0.95,0
JP2 = drill 0.914 long: 1 -2.54,0; 2 0,0; 3 2.54,0
HEXABIT_17.32_X2_NO_P5_P10_P11_P20 = smd 1 x 1 bottom: PAD_PD1 12.39,7.15; PAD_PD2 12.39,-7.15; PAD_PD3 12.39,-22.85; PAD_PD4 12.39,-37.15; PAD_PD6 -12.39,-37.15; PAD_PD7 -12.39,-22.85; PAD_PD8 -12.39,-7.15; PAD_PD9 -12.39,7.15; PAD_PD12 16.52,0; PAD_PD13 7.752,-15.072; PAD_PD14 16.52,-30; PAD_PD15 8.26,-44.31; PAD_PD16 -8.26,-44.31; PAD_PD17 -16.52,-30; PAD_PD18 -7.752,-15.072; PAD_PD19 -16.52,0 | smd 1 x 1: PAD_PU1 12.39,7.15; PAD_PU2 12.39,-7.15; PAD_PU3 12.39,-22.85; PAD_PU4 12.39,-37.15; PAD_PU6 -12.39,-37.15; PAD_PU7 -12.39,-22.85; PAD_PU8 -12.39,-7.15; PAD_PU9 -12.39,7.15; PAD_PU12 16.52,0; PAD_PU13 7.752,-15.072; PAD_PU14 16.52,-30; PAD_PU15 8.26,-44.31; PAD_PU16 -8.26,-44.31; PAD_PU17 -16.52,-30; PAD_PU18 -7.752,-15.072; PAD_PU19 -16.52,0
1751251 = drill 1.1 pad 1.7: 1 -3.5,-0.1; 2 0,-0.1; 3 3.5,-0.1
R-0603 = smd 1 x 1.1: 1 -0.85,0; 2 0.85,0
R-0805 = smd 1.3 x 1.5: 1 -0.95,0; 2 0.95,0
DO214AA = smd 1.8 x 2.2: A 2.55,0; C -2.55,0
STMICROELECTRONICS_STM32F091RBT6_1 = smd 1.3 x 0.3: 1 -5.65,3.75; 2 -5.65,3.25; 3 -5.65,2.75; 4 -5.65,2.25; 5 -5.65,1.75; 6 -5.65,1.25; 7 -5.65,0.75; 8 -5.65,0.25; 9 -5.65,-0.25; 10 -5.65,-0.75; 11 -5.65,-1.25; 12 -5.65,-1.75; 13 -5.65,-2.25; 14 -5.65,-2.75; 15 -5.65,-3.25; 16 -5.65,-3.75; 33 5.65,-3.75; 34 5.65,-3.25; 35 5.65,-2.75; 36 5.65,-2.25; 37 5.65,-1.75; 38 5.65,-1.25; 39 5.65,-0.75; 40 5.65,-0.25; 41 5.65,0.25; 42 5.65,0.75; 43 5.65,1.25; 44 5.65,1.75; 45 5.65,2.25; 46 5.65,2.75; 47 5.65,3.25; 48 5.65,3.75 | smd 0.3 x 1.3: 17 -3.75,-5.65; 18 -3.25,-5.65; 19 -2.75,-5.65; 20 -2.25,-5.65; 21 -1.75,-5.65; 22 -1.25,-5.65; 23 -0.75,-5.65; 24 -0.25,-5.65; 25 0.25,-5.65; 26 0.75,-5.65; 27 1.25,-5.65; 28 1.75,-5.65; 29 2.25,-5.65; 30 2.75,-5.65; 31 3.25,-5.65; 32 3.75,-5.65; 49 3.75,5.65; 50 3.25,5.65; 51 2.75,5.65; 52 2.25,5.65; 53 1.75,5.65; 54 1.25,5.65; 55 0.75,5.65; 56 0.25,5.65; 57 -0.25,5.65; 58 -0.75,5.65; 59 -1.25,5.65; 60 -1.75,5.65; 61 -2.25,5.65; 62 -2.75,5.65; 63 -3.25,5.65; 64 -3.75,5.65
RM_8 = smd 1.778 x 0.432: 1 -2.045,0.975; 2 -2.045,0.325; 3 -2.045,-0.325; 4 -2.045,-0.975; 5 2.045,-0.975; 6 2.045,-0.325; 7 2.045,0.325; 8 2.045,0.975
CP_16_19 = smd 1.067 x 0.254: 1 -1.765,0.975; 2 -1.765,0.325; 3 -1.765,-0.325; 4 -1.765,-0.975; 9 1.765,-0.975; 10 1.765,-0.325; 11 1.765,0.325; 12 1.765,0.975 | smd 0.254 x 1.067: 5 -0.975,-1.765; 6 -0.325,-1.765; 7 0.325,-1.765; 8 0.975,-1.765; 13 0.975,1.765; 14 0.325,1.765; 15 -0.325,1.765; 16 -0.975,1.765
RM_10 = smd 1.778 x 0.279: 1 -2.045,1; 2 -2.045,0.5; 3 -2.045,0; 4 -2.045,-0.5; 5 -2.045,-1; 6 2.045,-1; 7 2.045,-0.5; 8 2.045,0; 9 2.045,0.5; 10 2.045,1
XTALL_CSTCE8M00G52 = smd 1.4 x 0.4: P$1 0,1.2; P$2 0,0; P$3 0,-1.2

### Placement (x,y rotation side)
AIN  17.32,56.3 0 top
B  9.57,40.02 90 top
C  9.14,34.41 90 top
C1  9.78,22.73 0 bottom
C2  9.77,24.99 0 bottom
C3  23.72,10.31 90 bottom
C4  26.23,10.47 90 bottom
C5  25.78,14.69 180 bottom
C6  20.2,25.08 0 bottom
C7  10.76,10.75 270 bottom
C8  30.88,15.07 270 bottom
C9  24.66,22.31 180 bottom
C10  19.1,27.47 270 top
C11  4.62,14.01 90 top
C12  29.89,12.49 90 top
C13  20.75,18.33 180 top
C14  22.15,14.52 270 top
C15  21.77,42.97 90 top
C16  17.32,43.86 180 top
C17  12.75,43.22 270 top
C18  25.7,17.44 270 top
C19  23.92,17.7 270 top
C20  20.24,33.57 270 top
C21  10.21,26.2 180 top
C23  14.78,18.08 0 top
C24  21.77,39.41 90 top
C25  14.27,21.63 270 top
C26  12.75,39.54 90 top
C27  13.64,25.44 90 top
D  11.68,34.41 270 top
D1  3.97,17.34 180 top
D2  10.08,10.08 90 top
D3  24.56,10.08 270 top
D4  21.89,46.52 270 top
D5  12.75,46.52 90 top
F1  10.08,5 90 top
F2  24.56,4.74 90 top
FB1  7.41,11.85 90 top
FB2  16.94,15.03 90 top
FB3  27.48,12.23 90 top
FB4  7.8,11.85 90 bottom
JP1  5.64,44.87 270 top
JP2  29.13,44.75 270 top
P1  17.32,45 0 top
PWR  17.32,3.6 180 top
R  30.51,17.74 90 top
R1  6.35,16.65 0 top
R2  9.48,42.68 270 bottom
R3  24.69,42.97 180 top
R4  9.19,42.97 0 top
R5  20.75,30.27 180 top
R6  21,27.86 270 top
R7  13.26,29.12 180 top
R8  16.05,26.71 180 top
R9  17.32,41.44 0 top
R10  13.26,15.79 180 top
TVS1  14.4,11.22 90 top
TVS2  19.48,11.22 270 top
TVS3  12.75,50.84 0 top
TVS4  22.4,50.84 180 top
U1  17.32,17.31 0 bottom
U2  16.69,30.65 270 top
U3  24.69,23.41 90 top
U4  17.32,37.38 270 top
U5  11.35,21.25 270 top
X1  24.99,19.27 0 bottom

### Tracks (layer width: path | path; a pad name or v marks a point on that pad's centre or on a via)
+2.5V
  Top 0.254: U3.6 25.01,26.39 24.78,26.62 22.02,26.62 21.98,26.59
  Top 0.305: U5.1 14.11,23.3 C25.1 | U4.14 20.82,37.05 21.89,35.98 21.89,30.56 R5.1 21.98,29.89 21.98,26.59 21.98,25.66 20.24,23.92
  Top 0.406: C25.1 15.06,23.92 20.24,23.92
+15V  (via drill 0.35)
  Top 0.254: U2.7 17.01,29.58 17.32,29.89 v18.84,29.89
  Top 0.406: U4.16 21.56,38.36 C24.1 | U3.2 24.36,18.97 24.34,18.97 C19.1 | C13.1 22.46,18.55 C19.1 | C19.1 24.32,18.94 C18.1
  Top 0.61: D5.2 16.88,47.47 18.84,45.51 v19.48,45.51 20.73,45.51 D4.2 | C24.1 24.27,38.56 v24.31,38.52 | v18.72,20.62 19.35,19.98 20.88,19.98 22.25,18.61 C13.1 | v6.27,15.54 5.75,15.01 C11.3 | C10.1 18.84,28.58 v18.84,29.89
  Route15 0.61: AIN.5 24.31,56.19 24.31,45.51 | 24.31,45.51 v24.31,38.52 24.31,35.35 v18.84,29.89 18.84,20.74 v18.72,20.62 9.83,20.62 6.27,17.06 v6.27,15.54 | v19.48,45.51 24.31,45.51
-15V  (via drill 0.35)
  Top 0.406: U4.5 v14.53,38.36 13.08,38.36 C26.1
  Top 0.61: D4.1 19.41,47.47 v18.97,47.03 | v16.05,45.51 13.91,45.51 D5.1 | v22.15,11.35 C14.2 | v29,11.35 29.15,11.49 C12.1
  Route2 0.61: v29,11.35 v22.15,11.35 19.73,11.35 14.53,16.55 v14.53,38.36 14.53,43.98 v16.05,45.51 17.45,45.51 v18.97,47.03 20.82,48.88 AIN.4
AD8295_A1O  (via drill 0.35)
  Top 0.254: U4.7 U4.8 15.56,35.08 15.92,34.71 16.78,34.71 17.66,33.83 U2.1 17.66,31.85 v18.01,31.5
  Top 0.305: R8.1 17.28,26.71 17.66,27.09 U2.8 17.66,27.13 v17.7,27.09
  Bottom 0.305: v18.01,31.5 18.08,31.43 18.08,27.47 v17.7,27.09
AD8295_A1R1
  Top 0.254: U4.10 17,35.16 18.84,33.32 18.84,31.28 17.96,30.4 17.19,30.4 16.36,29.56 U2.6
  Top 0.305: U2.6 U2.5 14.63,28.6 R7.1
AD8295_A2O  (via drill 0.35)
  Top 0.305: U5.2 11.85,24.51 12.06,24.72 13.51,24.72 C27.1 13.76,24.72 16.6,24.72 v17.96,26.08 | v18.97,35.22 18.58,35.62 U4.12
  Bottom 0.305: v18.97,35.22 19.61,34.59 19.61,27.73 v17.96,26.08
AD8295_OUT  (via drill 0.35)
  Top 0.305: U4.15 17.9,37.71 v17.83,37.63 | U2.3 16.36,31.47 v16.3,31.41
  Bottom 0.305: v17.83,37.63 16.3,36.11 v16.3,31.41
AGND  (via drill 0.35)
  Top 0.406: C11.2-2 C11.2 7.03,14.01 v7.92,14.9 | v31.29,13 30.78,12.49 C12.2 C12.2-2 | U4.13 18.67,36.41 18.57,36.5 18.32,36.5 18.08,36.75
  Top 0.813: FB2.2 v18.21,15.98 19.23,15.98 | 19.23,15.98 22.1,15.98 C14.1 | C13.2 19.25,16 19.23,15.98
  Route15 0.406: v7.92,14.9 8.43,15.41 17.64,15.41 v18.21,15.98 28.31,15.98 v31.29,13
  Bottom 0.61: FB4.2 7.8,14.77 v7.92,14.9
  other vias: 11.99,58.34 15.54,58.34 19.1,58.34 22.53,58.34 14.78,51.48 15.8,53.26 17.7,51.35 7.16,40.81 26.85,41.06 12.49,6.01 14.65,6.01 18.97,6.01 21.89,5.76 15.54,2.33 18.97,2.2 19.99,26.33 12.24,26.08
  pour Route2 (isolate 0.305, no thermals): -0.02,45.02 8.61,59.99 25.96,59.99 34.59,45 25.96,30.01 34.59,15.03 25.96,0.04 8.68,0.04 -0.02,15.14 8.72,30.08
  pour Top (isolate 0.305, no thermals): -0.02,44.89 8.61,59.86 25.96,59.86 34.59,44.87 25.96,29.89 34.59,14.9 25.96,-0.08 8.68,-0.08 -0.02,15.01 8.72,29.95
B1  (via drill 0.35)
  Top 0.305: B.P$1 v10.46,40.02
  Bottom 0.305: U1.60 19.07,23.82 15.54,27.35 15.54,36.11 11.63,40.02 v10.46,40.02 B.P$1 9.57,41.73 R2.2
GND  (via drill 0.35)
  Top 0.406: C23.2 16.52,18.97 v17.19,18.97 | D1.C 4.73,18.09 v4.75,18.08
  Bottom 0.254: U1.47 12.57,20.56 12.75,20.74 | U1.63 20.57,23.84 20.11,24.3 | 20.88,10.58 arc-90 20.57,10.89 U1.18 20.57,12.44 arc-90 20.88,12.74 | U1.12 25.67,15.56 arc-90 26.21,15.03
  Bottom 0.305: U1.31 14.07,10.64 13.51,10.08 | U1.47 10.34,20.56 10.34,20.62
  Bottom 1.27: P1.PAD_PD13 25.07,32.18 v25.45,32.55
  other vias: 17.83,17.44 19.86,25.19 10.46,2.2 22.78,2.07 27.48,15.03 17.83,48.3 9.19,44.87 19.1,49.19 26.85,39.54 10.34,35.73
  pour Route15 (isolate 0.305, no thermals): -0.02,45.02 8.61,59.99 25.96,59.99 34.59,45 25.96,30.01 34.59,15.03 25.96,0.04 8.68,0.04 -0.02,15.14 8.72,30.08
  pour Bottom (isolate 0.305, no thermals): -0.02,44.89 8.61,59.86 25.96,59.86 34.59,44.87 25.96,29.89 34.59,14.9 25.96,-0.08 8.68,-0.08 -0.02,15.01 8.72,29.95
N$1
  Top 0.813: AIN.3 17.32,55.29 19.23,53.38 21.77,53.38 22.53,52.62 22.53,49.57 23.29,48.81 26.21,48.81 27.73,47.29 JP2.1
N$2
  Top 0.813: AIN.2 13.82,54.45 12.75,53.38 12.75,49.95 11.61,48.81 7.67,48.81 6.27,47.41 JP1.1
N$3  (via drill 0.35)
  Top 0.254: v7.9,17.06 7.61,17.06 R1.2
  Bottom 0.254: U1.41 8.4,17.56 v7.9,17.06
N$4
  Top 0.406: D1.A 4.02,16.65 R1.1
N$5
  Bottom 0.254: X1.P$1 24.41,20.47 23.92,19.98 23.92,19.35 23.64,19.06
  Bottom 0.305: 23.64,19.06 U1.5
N$6
  Bottom 0.305: U1.6 23.94,18.56 24.44,18.07 X1.P$3
N$7  (via drill 0.35)
  Top 0.254: v12.24,30.27 v12.24,33.44 12.24,33.85 D.P$1
  Bottom 0.254: v12.24,30.27 13,29.51 13,22.27 13.64,21.63 13.64,20.49 13.21,20.06 U1.46 | D.P$1 12.24,33.85 v12.24,33.44
N$8
  Top 0.813: TVS4.C 26.08,50.84 28.11,48.81 30.53,48.81 31.42,47.92 31.42,45.64 30.53,44.75 JP2.2 27.31,44.75 R3.1
N$9  (via drill 0.35)
  Top 0.254: C.P$1 v10.09,33.46
  Bottom 0.254: U1.49 13.57,29.98 v10.09,33.46 C.P$1
N$10
  Top 0.813: TVS3.C 9.56,50.21 7.41,50.21 6.14,48.94 4.37,48.94 3.35,47.92 3.35,46.14 4.62,44.87 JP1.2 6.44,44.87 R4.1
N$11
  Top 0.305: U4.1 20.24,41.09 20.24,43.82
  Top 0.813: R3.2 22.99,43.82 | 22.99,43.82 C15.2 20.24,43.82 18.21,43.82 C16.1 | D4.3 22.99,46.43 22.99,43.82
N$12
  Top 0.305: U4.4 14.4,41.09 14.4,43.56
  Top 0.406: C16.2 16.22,44.11 14.4,44.11 | 14.4,44.11 12.71,44.11 12.71,44.12 | 14.4,43.56 14.4,44.11
  Top 0.61: R4.2 11.15,44.07 11.61,44.07 11.65,44.12 | D5.3 11.65,44.12 | 11.65,44.12 12.71,44.12 C17.1
N$13
  Top 0.305: U4.2 17.65,40.82 R9.2
N$14
  Top 0.305: U4.3 17,40.82 R9.1
N$15
  Top 1.27: PWR.3 10.27,3.7 F1.1
N$16
  Top 1.27: PWR.1 24.11,3.7 F2.1
N$17
  Top 0.813: F1.2 D2.2 14.28,8.55 TVS1.C
N$18
  Top 0.813: F2.2 D3.1 24,8.67 TVS2.A
N$19
  Top 1.27: PWR.2 16.94,4.08 FB2.1 | TVS1.A 14.71,14.08 FB2.1 | FB2.1 19.17,14.08 TVS2.C
N$20
  Top 0.813: FB1.1 10.06,10.9 D2.1
N$21
  Top 0.813: D3.2 27.16,11.6 FB3.1
N$22
  Top 0.813: FB1.2 4.83,12.8 C11.1
N$23
  Top 0.813: C12.3 29.84,13.44 27.73,13.44 FB3.2
N$25
  Top 0.254: 19.9,33.16 18.4,34.66 18.13,34.66 17.65,35.15 U4.11
  Top 0.305: R6.1 20.92,28.71 20.37,29.25 20.37,29.8 R5.2 20.24,30.61 C20.2 19.9,33.06 19.9,33.16
N$26
  Top 0.254: U5.9 11.85,16.35 R10.2
N$27
  Top 0.305: R7.2 11.31,28.03 11.31,26.46 C21.1 11.35,25.91 U5.3
N$28  (via drill 0.35)
  Top 0.305: U5.4 10.85,24.29 9.32,25.82 9.32,26.16 C21.2 9.36,26.5 v10.59,27.73 | R8.2 15.2,26.97 14.42,27.74 v12.24,27.74
  Bottom 0.305: v12.24,27.74 10.6,27.74 v10.59,27.73
R1  (via drill 0.35)
  Top 0.254: v25.46,17.25 30.19,17.25 R.P$1 30.91,17.34 v30.91,16.68
  Bottom 0.254: U1.7 23.68,18.06 24.5,17.25 v25.46,17.25 | v30.91,16.68 30.91,17.06 30.89,17.08 30.89,17.36 R.P$1 30.88,17.36 C8.1
SPI2_CS  (via drill 0.35)
  Top 0.254: U5.6 10.35,18.47 8.94,17.06 8.94,14.14 v9.45,13.63
  Bottom 0.254: v9.45,13.63 9.51,13.56 U1.33
SPI2_MISO  (via drill 0.35)
  Top 0.254: U5.7 10.85,17.96 9.83,16.93 v9.83,16.43
  Bottom 0.254: v9.83,16.43 9.83,15.66 10.93,14.56 U1.35
SPI2_SCK  (via drill 0.35)
  Top 0.254: U5.8 11.35,17.57 10.59,16.81 10.59,15.92 9.77,15.09 v9.77,14.54
  Bottom 0.254: U1.34 10.24,14.06 v9.77,14.54
UART1_RX*
  Bottom 0.305: U1.43 8.52,18.56 P1.PAD_PD7
UART1_TX*  (via drill 0.35)
  Top 0.305: v6.14,19.6 4.93,20.81 P1.PAD_PU7
  Bottom 0.305: U1.42 7.68,18.06 v6.14,19.6
UART2_RX*
  Bottom 0.305: U1.17 21.96,12.55 27.16,12.55 29.46,14.85 29.46,21.9 P1.PAD_PD3
UART2_TX*  (via drill 0.35)
  Top 0.305: v28.62,19.35 28.62,21.06 P1.PAD_PU3
  Bottom 0.305: U1.16 23.61,13.56 23.99,13.18 26.78,13.18 28.62,15.03 v28.62,19.35
UART3_RX
  Bottom 0.305: U1.30 14.57,10.25 12.17,7.85 P1.PAD_PD6
UART3_TX  (via drill 0.35)
  Top 0.305: v8.05,6.65 6.13,6.65 P1.PAD_PU6
  Bottom 0.305: U1.29 15.07,9.73 11.99,6.65 v8.05,6.65
UART4_RX  (via drill 0.35)
  Top 0.305: v24.05,33.19 22.65,31.79 22.65,29 24.56,27.09 25.7,27.09 26.34,26.46 26.34,24.3 25.32,23.28 21.51,23.28 v19.73,21.51
  Bottom 0.305: U1.15 20.95,14.06 19.73,15.28 v19.73,21.51 | v24.05,33.19 27.73,36.87 28.73,36.87 P1.PAD_PD2
UART4_TX  (via drill 0.35)
  Top 0.305: v20.57,20.87 20.57,20.95 22.27,22.65 25.58,22.65 26.85,23.92 26.85,26.71 25.83,27.73 24.81,27.73 23.29,29.25 23.29,31.41 29.71,37.83 P1.PAD_PU2
  Bottom 0.305: U1.14 21.34,14.56 20.57,15.33 v20.57,20.87
UART5_RX
  Bottom 0.305: U1.56 17.07,24.74 14.91,26.9 14.91,35.6 12.66,37.85 P1.PAD_PD8
UART5_TX  (via drill 0.35)
  Top 0.305: v8.3,36.75 6.04,36.75 P1.PAD_PU8
  Bottom 0.305: U1.55 16.57,24.23 14.28,26.52 14.28,34.45 11.99,36.75 v8.3,36.75
UART6_RX
  Bottom 0.305: U1.21 19.07,9.21 21.51,6.77 28.63,6.77 P1.PAD_PD4
UART6_TX  (via drill 0.35)
  Top 0.305: P1.PAD_PU4 29.52,7.66 v26.59,7.66
  Bottom 0.305: U1.20 19.57,9.6 21.51,7.66 v26.59,7.66
UART7_RX
  Bottom 0.305: U1.9 21.76,17.06 21.26,17.57 21.26,21.76 22.02,22.52 22.02,26.33 20.24,28.11 20.24,36.84 P1.PAD_PD9
UART7_TX  (via drill 0.35)
  Top 0.305: v8.05,51.48 7.38,52.15 P1.PAD_PU9
  Bottom 0.305: U1.8 22.02,17.56 21.77,17.82 21.77,21.25 22.78,22.27 22.78,26.59 20.88,28.49 20.88,38.65 v8.05,51.48
UART8_RX
  Bottom 0.305: U1.11 26.48,16.06 27.73,17.31 27.73,20.62 27.23,21.12 27.23,25.32 23.16,29.38 23.16,45.6 P1.PAD_PD1
UART8_TX  (via drill 0.35)
  Top 0.305: v26.97,51.48 27.64,52.15 P1.PAD_PU1
  Bottom 0.305: U1.10 25.97,16.56 27.1,17.7 27.1,20.49 26.72,20.87 26.72,24.81 22.53,29 22.53,47.03 v26.97,51.48
VDD  (via drill 0.35)
  Top 0.305: R10.1 13.93,15.97 C23.1 13.48,18.08 v12.92,18.63 U5.10 12.35,20.89 11.73,21.51 10.84,21.51 v10.64,21.71
  Top 0.813: P1.PAD_PU19 v1.95,43.22 | v8.05,32.68 9.06,30.69 P1.PAD_PU18 v8.05,27.47 | P1.PAD_PU12 v32.81,43.22 | v26.72,32.68 25.58,30.69 P1.PAD_PU13 | v1.79,16.75 P1.PAD_PU17 v1.73,13.19 | v32.85,16.75 P1.PAD_PU14 v32.81,13.25 | v7.92,2.46 P1.PAD_PU16 P1.PAD_PU15 v26.6,2.42
  Route2 0.305: v21.13,25.95 25.19,30.01 | v24.94,13.89 29.99,13.89 v32.85,16.75 | v23.84,24.01 25.75,25.92 27.56,25.92
  Route2 0.813: v1.95,43.22 v8.05,32.68 | v32.81,43.22 v26.72,32.68 25.19,30.01 27.56,25.92 v32.85,16.75 | v1.79,16.75 v8.05,27.47 | v1.73,13.19 v7.92,2.46 | v26.6,2.42 v32.81,13.25
  Bottom 0.254: C9.1 23.84,22.33 v23.84,24.01
  Bottom 0.305: U1.48 11.28,21.06 v10.64,21.71 C1.1 | U1.64 21.07,24.08 C6.1 21.05,25.87 v21.13,25.95 | 23.89,21.98 U1.1 | C7.1 11.21,11.66 U1.32 13.57,12.68 14.02,13.12 | U1.13 24.56,15.06 C5.1 v24.93,13.89 v24.94,13.89 | C3.1 20.73,9.46 20.07,10.12 U1.19 20.07,12.66 19.61,13.12 14.02,13.12 | 14.02,13.12 14.02,17.54 v12.92,18.63
  Bottom 0.406: C1.1 10.64,24.9 C2.1 10.72,25.31 8.56,27.47 v8.05,27.47 | C3.1 23.79,9.52 C4.1 | C9.1 23.81,22.05 23.89,21.98

### Text on the board
tPlace: P8 | P1 | 3V3 | 3V3 | GND | GND | P7 | P2* | 3V3 | 3V3 | P3 | P6* | 3V3 | 3V3 | P4 | P5 | 3V3 | 3V3
bPlace: IN- | IN+ | OUT+ | OUT- | P8 | SHIELD | P1 | -15V | +15V | GND | GND | AIN 0..+10V | AIN -10..0V | P7 | P2* | GND | GND | P3 | P6* | GND | GND | P4 | P5 | H26R10 | +15V | -15V | GND | GND | GND
bNames: B | C | D | R
Document: Total Thickness 1.6 mm / --------------------------------------------------------- / / copper_top_l1.gbr : Top Conductor - Copper: Thickness 0.035 mm / / Dielectric - FR-4: Thickness 0.175 mm / / copper_inner_l2.gbr : GND Plane - Copper: Thickness 0.035 mm / / Dielectric - FR-4: Thickness 1.11 mm / / copper_inner_l3.gbr : VDD Plane - Copper: Thickness 0.035 mm / / Dielectric - FR-4: Thickness 0.175 mm / / copper_bottom_l4.gbr : Bottom Conductor - Copper: Thickness 0.035 mm